# Altium schematic sheet Connections.SchDoc
size A4
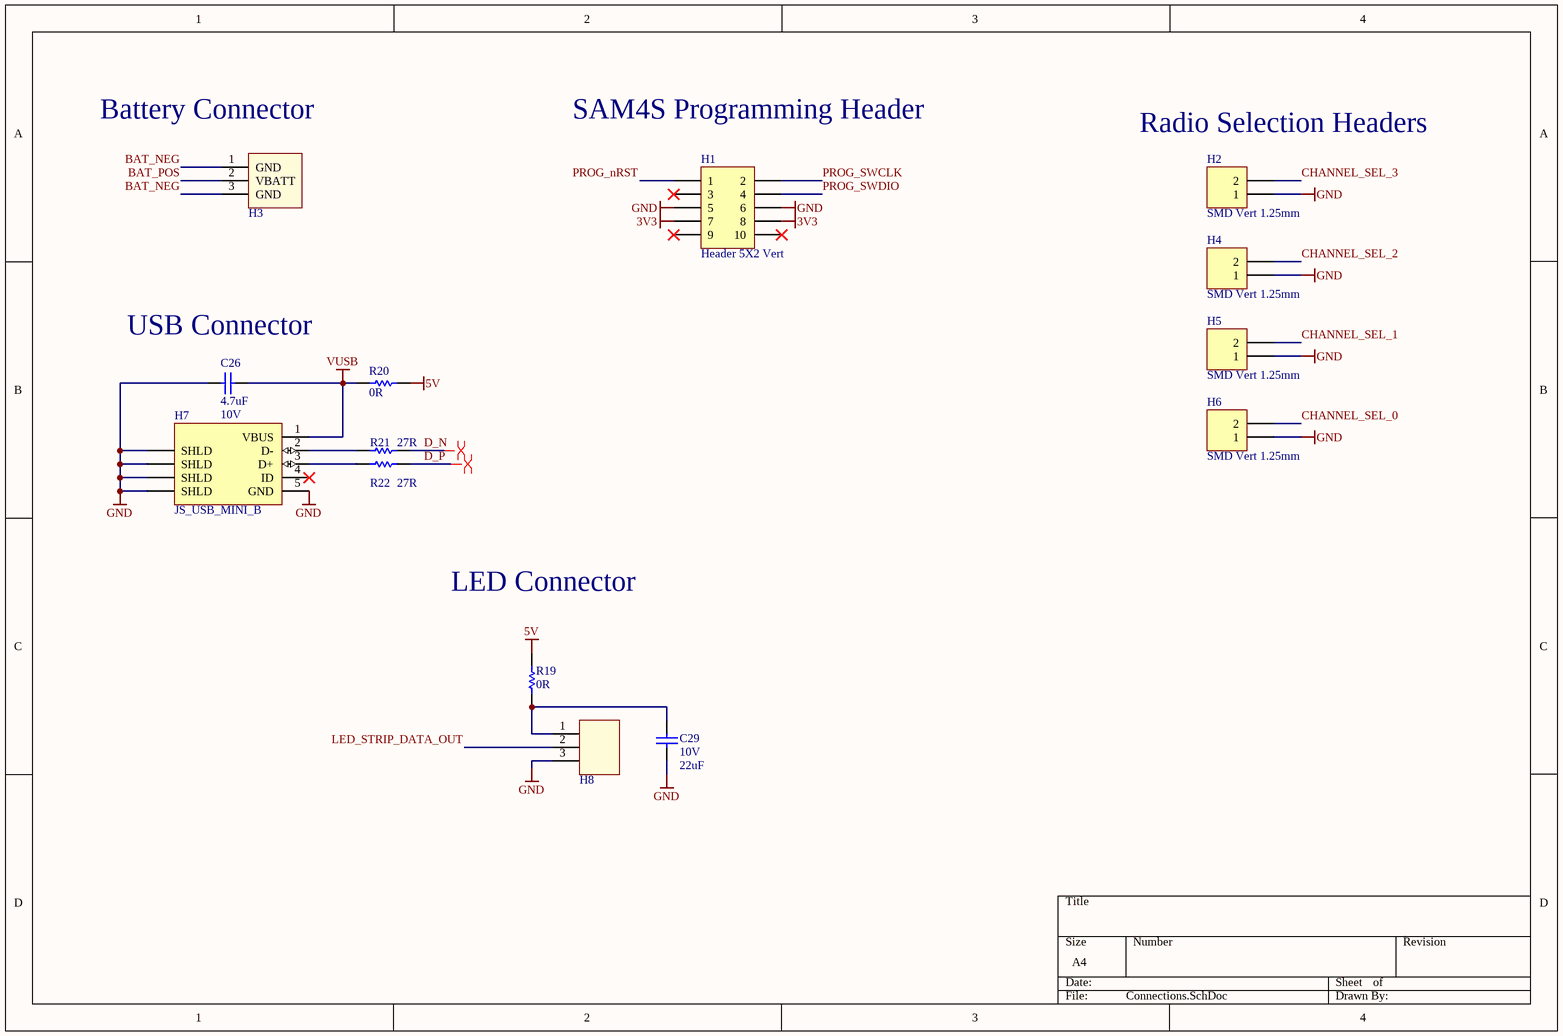
[diagram p0: Connections.SchDoc]

## Parts
C26  Max Voltage: 10V  [CAPC1608N]  (hidden comment: 4.7uF)
C29  Max Voltage: 10V  [CAPC3216L]  (hidden comment: 22uF)
H1  Header 5X2 Vert  [IDC2.54-V10D]
H2  SMD Vert 1.25mm  [SD-53398-0219]
H3  Battery_HEADER_3pin  [BATT_HEADER_3POS]  (value not drawn)
H4  SMD Vert 1.25mm  [SD-53398-0219]
H5  SMD Vert 1.25mm  [SD-53398-0219]
H6  SMD Vert 1.25mm  [SD-53398-0219]
H7  JS_USB_MINI_B  [USB/SM0.8-6H5]
H8  HEADER_3  [HEADER_3POS]  (value not drawn)
R19  0R  [RESC1608L]
R20  0R  [RESC1608L]
R21  27R  [RESC1608L]
R22  27R  [RESC1608L]

## Nets
3V3: H1.7 H1.8
5V: R19.2 R20.2
GND: C26.2 C29.1 H1.5 H1.6 H2.1 H4.1 H5.1 H6.1 H7.5(GND) H7.6(SHLD) H7.7(SHLD) H7.8(SHLD) H7.9(SHLD) H8.3
VUSB: C26.1 H7.1(VBUS) R20.1
BAT_NEG: H3.1(GND) H3.3(GND)
BAT_POS: H3.2(VBATT)
CHANNEL_SEL_0: H6.2
CHANNEL_SEL_1: H5.2
CHANNEL_SEL_2: H4.2
CHANNEL_SEL_3: H2.2
D_N: R21.2
D_P: R22.2
LED_STRIP_DATA_OUT: H8.2
PROG_nRST: H1.1
PROG_SWCLK: H1.2
PROG_SWDIO: H1.4
NetC29_2: C29.2 H8.1 R19.1
NetH7_2: H7.2(D-) R21.1
NetH7_3: H7.3(D+) R22.1

Not connected (* = marked no-connect by the designer): H1 3* 9* 10*; H7 4(ID)*

## Layout directives
differential pair: D_N, D_P

## Notes on the sheet
- (near H3) Battery Connector
- SAM4S Programming Header
- (near H2) Radio Selection Headers
- (near C26) USB Connector
- LED Connector

## Library data of the parts
C26 = CC_4.7uF_0603: CAP CER 4.7uF X5R +-20%  10V 0603; Note: Footprint corresponds to dimensions for bulk cassette packaging. This case size has tightened tolerances.; PackageReference: 0805; Code_IPC: 2012[0805]; Verify: *; Supplier: ECE Dept; Storage Location: PCB Assembly WS; Value: 4.7uF
C29 = CC_22uF_1206: CAP CER 22uF Y5V -20% +80% 10V 1206; Verify: *; Supplier: ECE Dept; Storage Location: PCB Assembly WS; Dielectric: Y5V; Footprint: 1206 (3216 metric); Value: 22uF
H1 = JA_HDR_IDC_5X2_VERT: IDC Header, 2,54mm, 10-Pin, Vert; Supplier: ECE Dept; Supplier 1: Farnell; Supplier Part Number 1: 1096985; Storage Location: ECE Dept Store
H2 H4-H6 = JB_53398-02: Header_Vert_2Pos_1.25mm_125V@1A_SMT; Manufacturer: Molex Inc; Manufacturer Part Number: 0533980271; Number of Positions: 2; Pitch: 0.049" (1.25mm); Contact Type: Blade Pin; Mounting Type: Surface Mount; Supplier 1: Digi-Key; Supplier Part Number 1: WM7606CT-ND; Supplier: ECE Dept; Storage Location: PCB Assembly WS; Value: SMD Vert 1.25mm
H3 = Battery_HEADER_3pin: 3Pin Header 2.54mm spacing
H7 = JS_USB_MINI_B_SMT: USB 2.0, Right Angle, SMT, B Type, Receptacle, 5 Position,; Manufacturer: FCI; Manufacturer PN: 10033526-N3212MLF; Supplier 1: Farnell; Supplier Part Number 1: 1824416; Storage Location: PCB Assembly WS; Supplier: ECE Dept
H8 = HEADER_3: 3Pin Header 2.54mm spacing
R19 R20 = RS_0R0: RES 0.0 OHM 1/10W 5% 0603 SMD; Storage Location: PCB Assembly WS; Supplier: ECE Dept; Value: 0R
R21 R22 = RS_27R: RES 27 OHM 1/10W 5% 0603 SMD; Storage Location: PCB Assembly WS; Supplier: ECE Dept; Value: 27R